# Altium project KB-Mouse Interface.PrjPCB
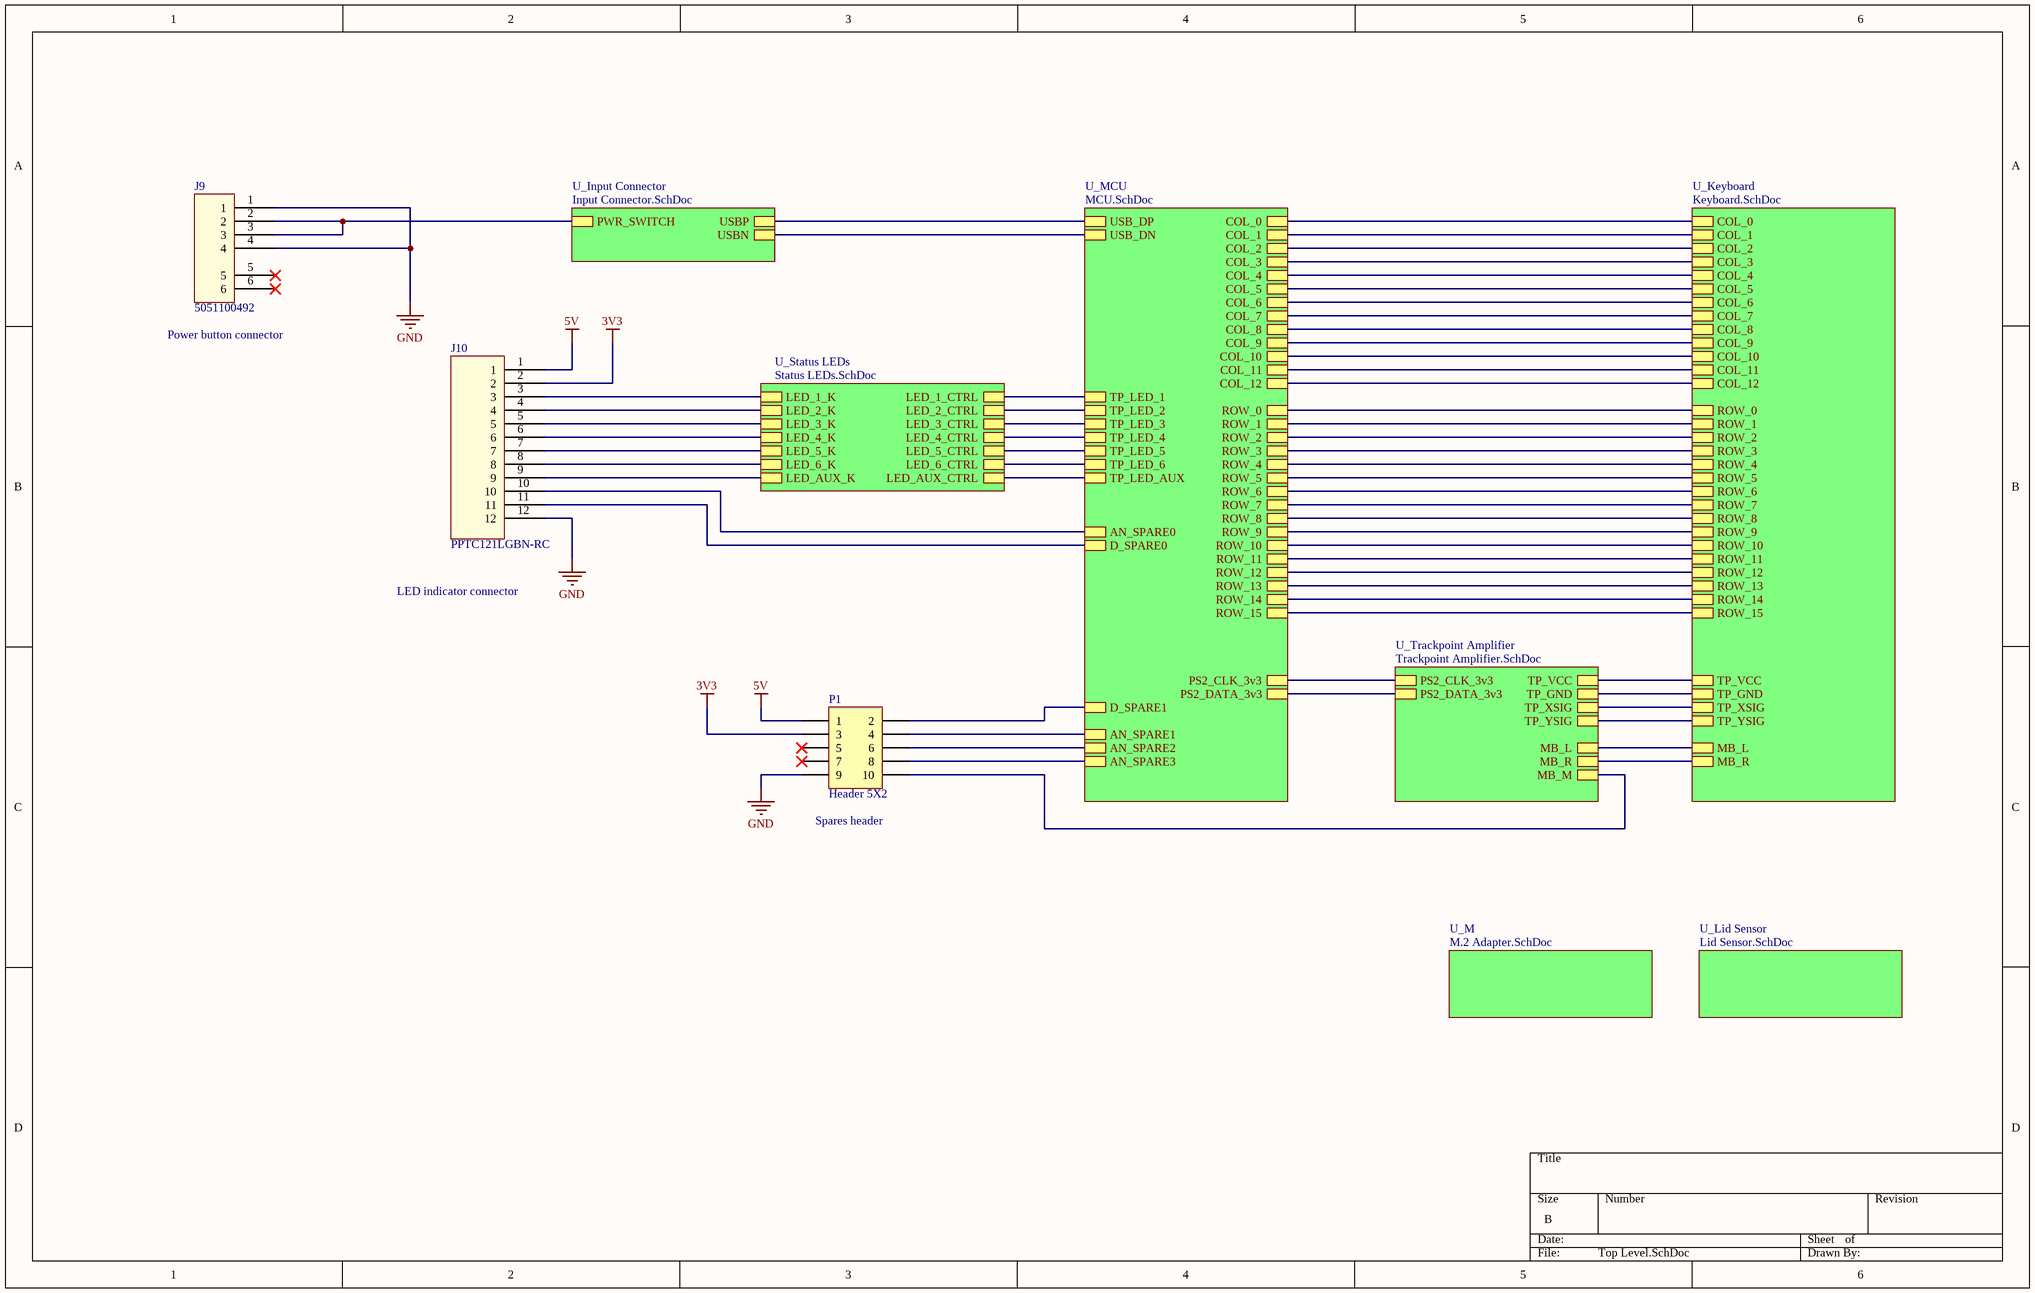
[diagram p0: Top Level.SchDoc]
8 sheets, 66 parts. Net scope: hierarchical (ports join the sheet entries above them; power ports are global).
Board file: KB-Mouse Interface.PcbDoc
Sheets:
  Top Level.SchDoc
    U_Input Connector = Input Connector.SchDoc
    U_Keyboard = Keyboard.SchDoc
    U_MCU = MCU.SchDoc
    U_Status LEDs = Status LEDs.SchDoc
    U_Trackpoint Amplifier = Trackpoint Amplifier.SchDoc
    U_Lid Sensor = Lid Sensor.SchDoc
    U_M = M.2 Adapter.SchDoc

## Sheet Top Level.SchDoc
size B

### Parts
J9  5051100492  [5051100492]
J10  PPTC121LGBN-RC  [PPTC121LGBN-RC]
P1  Header 5X2  [HDR2X5]

### Sub-sheets
U_Input Connector = Input Connector.SchDoc: USBN, USBP, PWR_SWITCH
U_Keyboard = Keyboard.SchDoc: MB_L, MB_R, COL_1, COL_2, COL_3, COL_4, COL_5, COL_6, COL_7, COL_8, COL_9, COL_10, COL_11, COL_12, COL_0, ROW_1, ROW_2, ROW_3, ROW_4, ROW_5, ROW_6, ROW_7, ROW_0, ROW_9, ROW_10, ROW_11, ROW_12, ROW_13, ROW_14, ROW_15, ROW_8, TP_GND, TP_XSIG, TP_YSIG, TP_VCC
U_Lid Sensor = Lid Sensor.SchDoc: no entries
U_M = M.2 Adapter.SchDoc: no entries
U_MCU = MCU.SchDoc: USB_DP, USB_DN, AN_SPARE2, AN_SPARE1, TP_LED_1, TP_LED_2, TP_LED_3, TP_LED_4, TP_LED_5, TP_LED_6, COL_1, COL_2, COL_3, COL_4, COL_5, COL_6, COL_7, COL_8, COL_9, COL_10, COL_11, COL_12, COL_0, ROW_1, ROW_2, ROW_3, ROW_4, ROW_5, ROW_6, ROW_7, ROW_0, ROW_9, ROW_10, ROW_11, ROW_12, ROW_13, ROW_14, ROW_15, ROW_8, PS2_CLK_3v3, PS2_DATA_3v3, TP_LED_AUX, D_SPARE0, D_SPARE1, AN_SPARE0, AN_SPARE3
U_Status LEDs = Status LEDs.SchDoc: LED_1_CTRL, LED_1_K, LED_2_CTRL, LED_2_K, LED_3_CTRL, LED_3_K, LED_4_CTRL, LED_4_K, LED_5_CTRL, LED_5_K, LED_6_CTRL, LED_6_K, LED_AUX_CTRL, LED_AUX_K
U_Trackpoint Amplifier = Trackpoint Amplifier.SchDoc: TP_VCC, TP_GND, TP_XSIG, TP_YSIG, PS2_DATA_3v3, PS2_CLK_3v3, MB_M, MB_R, MB_L

### Nets
3V3: J10.2 P1.3
5V: J10.1 P1.1
GND: J9.1 J9.4 J10.12 P1.9
COL_0: sheet U_Keyboard/COL_0, sheet U_MCU/COL_0
COL_1: sheet U_Keyboard/COL_1, sheet U_MCU/COL_1
COL_2: sheet U_Keyboard/COL_2, sheet U_MCU/COL_2
COL_3: sheet U_Keyboard/COL_3, sheet U_MCU/COL_3
COL_4: sheet U_Keyboard/COL_4, sheet U_MCU/COL_4
COL_5: sheet U_Keyboard/COL_5, sheet U_MCU/COL_5
COL_6: sheet U_Keyboard/COL_6, sheet U_MCU/COL_6
COL_7: sheet U_Keyboard/COL_7, sheet U_MCU/COL_7
COL_8: sheet U_Keyboard/COL_8, sheet U_MCU/COL_8
COL_9: sheet U_Keyboard/COL_9, sheet U_MCU/COL_9
COL_10: sheet U_Keyboard/COL_10, sheet U_MCU/COL_10
COL_11: sheet U_Keyboard/COL_11, sheet U_MCU/COL_11
COL_12: sheet U_Keyboard/COL_12, sheet U_MCU/COL_12
ROW_0: sheet U_Keyboard/ROW_0, sheet U_MCU/ROW_0
ROW_1: sheet U_Keyboard/ROW_1, sheet U_MCU/ROW_1
ROW_2: sheet U_Keyboard/ROW_2, sheet U_MCU/ROW_2
ROW_3: sheet U_Keyboard/ROW_3, sheet U_MCU/ROW_3
ROW_4: sheet U_Keyboard/ROW_4, sheet U_MCU/ROW_4
ROW_5: sheet U_Keyboard/ROW_5, sheet U_MCU/ROW_5
ROW_6: sheet U_Keyboard/ROW_6, sheet U_MCU/ROW_6
ROW_7: sheet U_Keyboard/ROW_7, sheet U_MCU/ROW_7
ROW_8: sheet U_Keyboard/ROW_8, sheet U_MCU/ROW_8
ROW_9: sheet U_Keyboard/ROW_9, sheet U_MCU/ROW_9
ROW_10: sheet U_Keyboard/ROW_10, sheet U_MCU/ROW_10
ROW_11: sheet U_Keyboard/ROW_11, sheet U_MCU/ROW_11
ROW_12: sheet U_Keyboard/ROW_12, sheet U_MCU/ROW_12
ROW_13: sheet U_Keyboard/ROW_13, sheet U_MCU/ROW_13
ROW_14: sheet U_Keyboard/ROW_14, sheet U_MCU/ROW_14
ROW_15: sheet U_Keyboard/ROW_15, sheet U_MCU/ROW_15
NetC1_2: sheet U_Keyboard/MB_L, sheet U_Trackpoint Amplifier/MB_L
NetC2_2: sheet U_Keyboard/MB_R, sheet U_Trackpoint Amplifier/MB_R
NetJ2_40: sheet U_Input Connector/USBN, sheet U_MCU/USB_DN
NetJ2_42: sheet U_Input Connector/USBP, sheet U_MCU/USB_DP
NetJ2_44: J9.2 J9.3 ; sheet U_Input Connector/PWR_SWITCH
NetJ3_1: sheet U_Keyboard/TP_XSIG, sheet U_Trackpoint Amplifier/TP_XSIG
NetJ3_2: sheet U_Keyboard/TP_VCC, sheet U_Trackpoint Amplifier/TP_VCC
NetJ3_3: sheet U_Keyboard/TP_YSIG, sheet U_Trackpoint Amplifier/TP_YSIG
NetJ3_5: sheet U_Keyboard/TP_GND, sheet U_Trackpoint Amplifier/TP_GND
NetJ10_3: J10.3 ; sheet U_Status LEDs/LED_1_K
NetJ10_4: J10.4 ; sheet U_Status LEDs/LED_2_K
NetJ10_5: J10.5 ; sheet U_Status LEDs/LED_3_K
NetJ10_6: J10.6 ; sheet U_Status LEDs/LED_4_K
NetJ10_7: J10.7 ; sheet U_Status LEDs/LED_5_K
NetJ10_8: J10.8 ; sheet U_Status LEDs/LED_6_K
NetJ10_9: J10.9 ; sheet U_Status LEDs/LED_AUX_K
NetJ10_10: J10.10 ; sheet U_MCU/AN_SPARE0
NetJ10_11: J10.11 ; sheet U_MCU/D_SPARE0
NetP1_2: P1.2 ; sheet U_MCU/D_SPARE1
NetP1_4: P1.4 ; sheet U_MCU/AN_SPARE1
NetP1_6: P1.6 ; sheet U_MCU/AN_SPARE2
NetP1_8: P1.8 ; sheet U_MCU/AN_SPARE3
NetP1_10: P1.10 ; sheet U_Trackpoint Amplifier/MB_M
NetQ1_2: sheet U_MCU/TP_LED_1, sheet U_Status LEDs/LED_1_CTRL
NetQ2_2: sheet U_MCU/TP_LED_2, sheet U_Status LEDs/LED_2_CTRL
NetQ3_2: sheet U_MCU/TP_LED_3, sheet U_Status LEDs/LED_3_CTRL
NetQ4_2: sheet U_MCU/TP_LED_4, sheet U_Status LEDs/LED_4_CTRL
NetQ5_2: sheet U_MCU/TP_LED_5, sheet U_Status LEDs/LED_5_CTRL
NetQ6_2: sheet U_MCU/TP_LED_6, sheet U_Status LEDs/LED_6_CTRL
NetQ7_2: sheet U_MCU/TP_LED_AUX, sheet U_Status LEDs/LED_AUX_CTRL
NetQ8_1: sheet U_MCU/PS2_DATA_3v3, sheet U_Trackpoint Amplifier/PS2_DATA_3v3
NetQ9_1: sheet U_MCU/PS2_CLK_3v3, sheet U_Trackpoint Amplifier/PS2_CLK_3v3

Not connected (* = marked no-connect by the designer): J9 5* 6*; P1 5* 7*

### Notes on the sheet
- (near J9) Power button connector
- LED indicator connector
- (near P1) Spares header

### Library data of the parts
J9 = 5051100492: CONN FPC BOTTOM 4POS .5MM R/A
J10 = PPTC121LGBN-RC: CONN HDR 12POS 0.1 TIN PCB R/A
P1 = Header 5X2: Header, 5-Pin, Dual row; LatestRevisionDate: 17-Jul-2002; LatestRevisionNote: Re-released for DXP Platform.; Publisher: Altium Limited

## Sheet Input Connector.SchDoc
size B
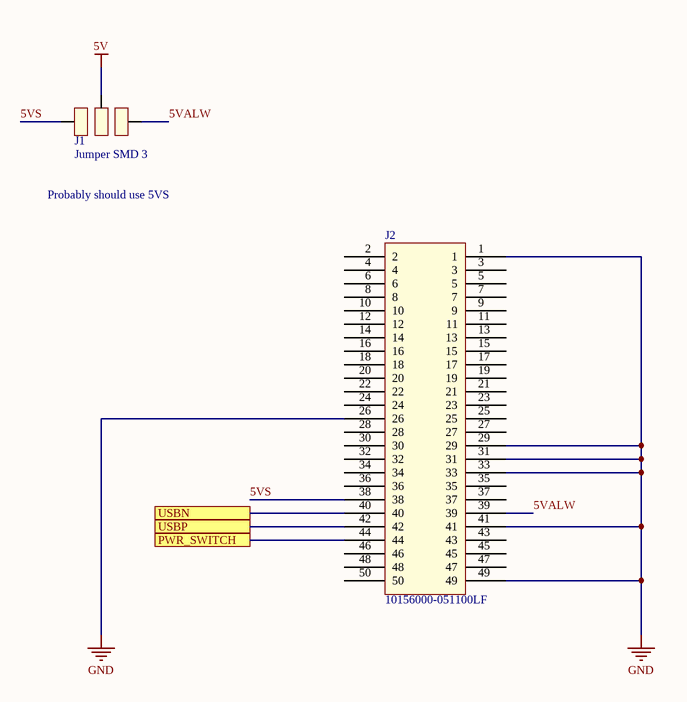
[diagram p1: Input Connector.SchDoc]

### Parts
J1  Jumper SMD 3  [Jumper SMD 3]
J2  10156000-051100LF  [10156000-051100LF]

### Ports
PWR_SWITCH, USBN, USBP

### Nets
5V: J1.2
GND: J2.1 J2.26 J2.29 J2.31 J2.33 J2.41 J2.49
5VALW: J1.1 J2.39
5VS: J1.3 J2.38
NetJ2_40: J2.40 ; port USBN
NetJ2_42: J2.42 ; port USBP
NetJ2_44: J2.44 ; port PWR_SWITCH

Not connected (* = marked no-connect by the designer): J2 2 3 4 5 6 7 8 9 10 11 12 13 14 15 16 17 18 19 20 21 22 23 24 25 27 28 30 32 34 35 36 37 43 45 46 47 48 50

### Notes on the sheet
- Probably should use 5VS

## Sheet Keyboard.SchDoc
size B
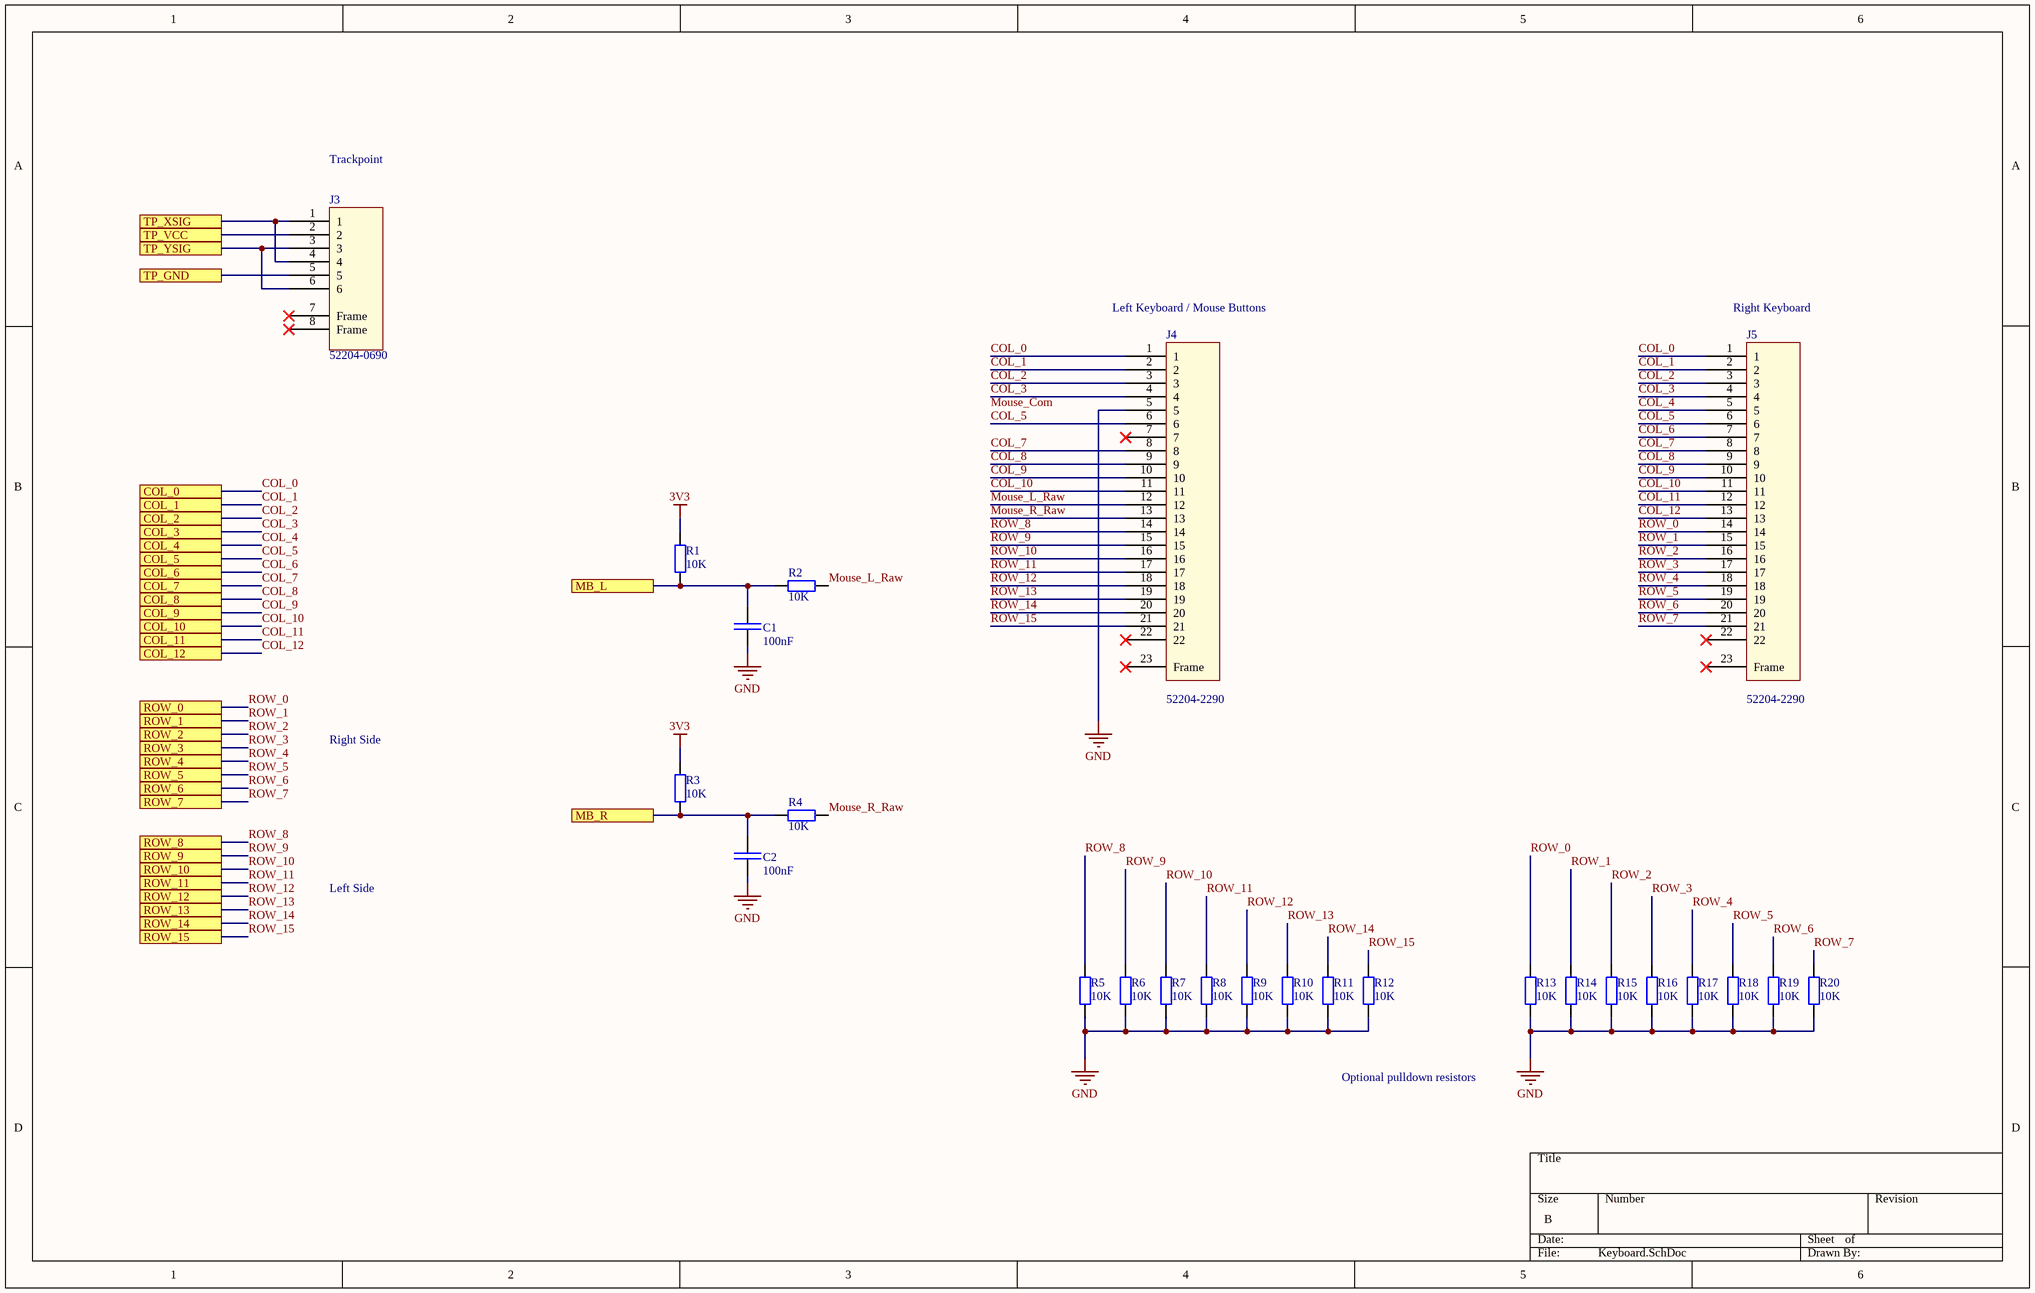
[diagram p2: Keyboard.SchDoc]

### Parts
C1  100nF  [CAP_SM0603_YAGEOCC2_N]
C2  100nF  [CAP_SM0603_YAGEOCC2_N]
J3  52204-0690  [52204-0690]
J4  52204-2290  [52204-2290]
J5  52204-2290  [52204-2290]
R1  10K  [RES_SM0603_YAGEORC_N]
R2  10K  [RES_SM0603_YAGEORC_N]
R3  10K  [RES_SM0603_YAGEORC_N]
R4  10K  [RES_SM0603_YAGEORC_N]
R5  10K  [RES_SM0603_YAGEORC_N]
R6  10K  [RES_SM0603_YAGEORC_N]
R7  10K  [RES_SM0603_YAGEORC_N]
R8  10K  [RES_SM0603_YAGEORC_N]
R9  10K  [RES_SM0603_YAGEORC_N]
R10  10K  [RES_SM0603_YAGEORC_N]
R11  10K  [RES_SM0603_YAGEORC_N]
R12  10K  [RES_SM0603_YAGEORC_N]
R13  10K  [RES_SM0603_YAGEORC_N]
R14  10K  [RES_SM0603_YAGEORC_N]
R15  10K  [RES_SM0603_YAGEORC_N]
R16  10K  [RES_SM0603_YAGEORC_N]
R17  10K  [RES_SM0603_YAGEORC_N]
R18  10K  [RES_SM0603_YAGEORC_N]
R19  10K  [RES_SM0603_YAGEORC_N]
R20  10K  [RES_SM0603_YAGEORC_N]

### Ports
COL_0, COL_1, COL_2, COL_3, COL_4, COL_5, COL_6, COL_7, COL_8, COL_9, COL_10, COL_11, COL_12, MB_L, MB_R, ROW_0, ROW_1, ROW_2, ROW_3, ROW_4, ROW_5, ROW_6, ROW_7, ROW_8, ROW_9, ROW_10, ROW_11, ROW_12, ROW_13, ROW_14, ROW_15, TP_GND, TP_VCC, TP_XSIG, TP_YSIG

### Nets
3V3: R1.1 R3.1
GND: C1.1 C2.1 J4.5 R5.2 R6.2 R7.2 R8.2 R9.2 R10.2 R11.2 R12.2 R13.2 R14.2 R15.2 R16.2 R17.2 R18.2 R19.2 R20.2
COL_0: J4.1 J5.1 ; port COL_0
COL_1: J4.2 J5.2 ; port COL_1
COL_2: J4.3 J5.3 ; port COL_2
COL_3: J4.4 J5.4 ; port COL_3
COL_4: J5.5 ; port COL_4
COL_5: J4.6 J5.6 ; port COL_5
COL_6: J5.7 ; port COL_6
COL_7: J4.8 J5.8 ; port COL_7
COL_8: J4.9 J5.9 ; port COL_8
COL_9: J4.10 J5.10 ; port COL_9
COL_10: J4.11 J5.11 ; port COL_10
COL_11: J5.12 ; port COL_11
COL_12: J5.13 ; port COL_12
Mouse_L_Raw: J4.12 R2.1
Mouse_R_Raw: J4.13 R4.1
ROW_0: J5.14 R13.1 ; port ROW_0
ROW_1: J5.15 R14.1 ; port ROW_1
ROW_2: J5.16 R15.1 ; port ROW_2
ROW_3: J5.17 R16.1 ; port ROW_3
ROW_4: J5.18 R17.1 ; port ROW_4
ROW_5: J5.19 R18.1 ; port ROW_5
ROW_6: J5.20 R19.1 ; port ROW_6
ROW_7: J5.21 R20.1 ; port ROW_7
ROW_8: J4.14 R5.1 ; port ROW_8
ROW_9: J4.15 R6.1 ; port ROW_9
ROW_10: J4.16 R7.1 ; port ROW_10
ROW_11: J4.17 R8.1 ; port ROW_11
ROW_12: J4.18 R9.1 ; port ROW_12
ROW_13: J4.19 R10.1 ; port ROW_13
ROW_14: J4.20 R11.1 ; port ROW_14
ROW_15: J4.21 R12.1 ; port ROW_15
NetC1_2: C1.2 R1.2 R2.2 ; port MB_L
NetC2_2: C2.2 R3.2 R4.2 ; port MB_R
NetJ3_1: J3.1 J3.4 ; port TP_XSIG
NetJ3_2: J3.2 ; port TP_VCC
NetJ3_3: J3.3 J3.6 ; port TP_YSIG
NetJ3_5: J3.5 ; port TP_GND

Not connected (* = marked no-connect by the designer): J3 7(Frame)* 8(Frame)*; J4 7* 22* 23(Frame)*; J5 22* 23(Frame)*

### Notes on the sheet
- Trackpoint
- (near J4) Left Keyboard / Mouse Buttons
- (near J5) Right Keyboard
- Right Side
- Left Side
- Optional pulldown resistors
- Labels drawn without touching a wire or pin: Mouse_Com

### Library data of the parts
C1 C2 = CC0603KRX7R9BB104: CAP 100nF SM0603 X7R 50V YAGEO CC2; Tolerance (%): 10; Voltage Rating (Volts): 50; Value: 100nF; Category: Capacitor; Manufacturer: Yageo; Manufacturer Part Number: CC0603KRX7R9BB104; Package: 0603; Supplier Part Number 1: 1362556; Supplier 1: Farnell; ComponentLink1URL: http://www.yageo.com; ComponentLink1Description: Manufacturer Website; Supplier 2: Digi-Key; Supplier Part Number 2: 311-1344-1-ND
R1-R20 = RC0603FR-0710KL: RES 10K SM0603 YAGEO RC_L; Power (Watts): 0.1; Resistance (Ohms): 10000; Tolerance (%): 1; Value: 10K; Category: Resistor; Manufacturer: Yageo; Manufacturer Part Number: RC0603FR-0710KL; Package: 0603; Supplier Part Number 1: 9238603; Supplier 1: Farnell; ComponentLink1URL: http://www.yageo.com; ComponentLink1Description: Manufacturer Website; Supplier 2: Digi-Key; Supplier Part Number 2: 311-10.0KHRCT-ND

## Sheet MCU.SchDoc
size B
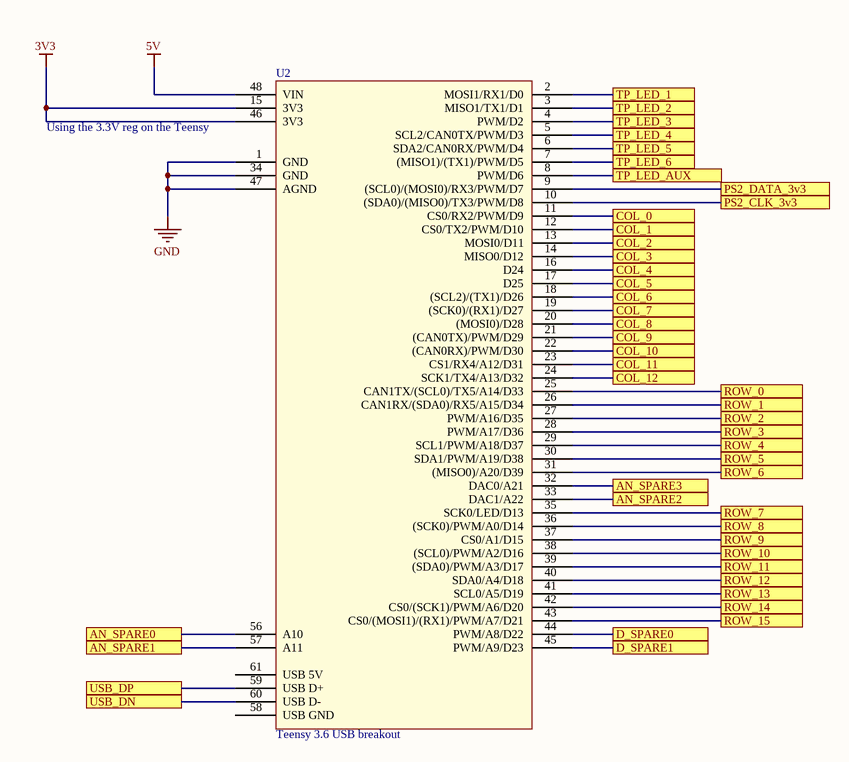
[diagram p3: MCU.SchDoc]

### Parts
U2  Teensy 3.6 USB breakout  [Teensy 3.6 - USB Breakout]

### Ports
AN_SPARE0, AN_SPARE1, AN_SPARE2, AN_SPARE3, COL_0, COL_1, COL_2, COL_3, COL_4, COL_5, COL_6, COL_7, COL_8, COL_9, COL_10, COL_11, COL_12, D_SPARE0, D_SPARE1, PS2_CLK_3v3, PS2_DATA_3v3, ROW_0, ROW_1, ROW_2, ROW_3, ROW_4, ROW_5, ROW_6, ROW_7, ROW_8, ROW_9, ROW_10, ROW_11, ROW_12, ROW_13, ROW_14, ROW_15, TP_LED_1, TP_LED_2, TP_LED_3, TP_LED_4, TP_LED_5, TP_LED_6, TP_LED_AUX, USB_DN, USB_DP

### Nets
3V3: U2.15(3V3) U2.46(3V3)
5V: U2.48(VIN)
GND: U2.1(GND) U2.34(GND) U2.47(AGND)
COL_0: U2.11(CS0/RX2/PWM/D9) ; port COL_0
COL_1: U2.12(CS0/TX2/PWM/D10) ; port COL_1
COL_2: U2.13(MOSI0/D11) ; port COL_2
COL_3: U2.14(MISO0/D12) ; port COL_3
COL_4: U2.16(D24) ; port COL_4
COL_5: U2.17(D25) ; port COL_5
COL_6: U2.18((SCL2)/(TX1)/D26) ; port COL_6
COL_7: U2.19((SCK0)/(RX1)/D27) ; port COL_7
COL_8: U2.20((MOSI0)/D28) ; port COL_8
COL_9: U2.21((CAN0TX)/PWM/D29) ; port COL_9
COL_10: U2.22((CAN0RX)/PWM/D30) ; port COL_10
COL_11: U2.23(CS1/RX4/A12/D31) ; port COL_11
COL_12: U2.24(SCK1/TX4/A13/D32) ; port COL_12
ROW_0: U2.25(CAN1TX/(SCL0)/TX5/A14/D33) ; port ROW_0
ROW_1: U2.26(CAN1RX/(SDA0)/RX5/A15/D34) ; port ROW_1
ROW_2: U2.27(PWM/A16/D35) ; port ROW_2
ROW_3: U2.28(PWM/A17/D36) ; port ROW_3
ROW_4: U2.29(SCL1/PWM/A18/D37) ; port ROW_4
ROW_5: U2.30(SDA1/PWM/A19/D38) ; port ROW_5
ROW_6: U2.31((MISO0)/A20/D39) ; port ROW_6
ROW_7: U2.35(SCK0/LED/D13) ; port ROW_7
ROW_8: U2.36((SCK0)/PWM/A0/D14) ; port ROW_8
ROW_9: U2.37(CS0/A1/D15) ; port ROW_9
ROW_10: U2.38((SCL0)/PWM/A2/D16) ; port ROW_10
ROW_11: U2.39((SDA0)/PWM/A3/D17) ; port ROW_11
ROW_12: U2.40(SDA0/A4/D18) ; port ROW_12
ROW_13: U2.41(SCL0/A5/D19) ; port ROW_13
ROW_14: U2.42(CS0/(SCK1)/PWM/A6/D20) ; port ROW_14
ROW_15: U2.43(CS0/(MOSI1)/(RX1)/PWM/A7/D21) ; port ROW_15
NetJ2_40: U2.60(USB_D-) ; port USB_DN
NetJ2_42: U2.59(USB_D+) ; port USB_DP
NetJ10_10: U2.56(A10) ; port AN_SPARE0
NetJ10_11: U2.44(PWM/A8/D22) ; port D_SPARE0
NetP1_2: U2.45(PWM/A9/D23) ; port D_SPARE1
NetP1_4: U2.57(A11) ; port AN_SPARE1
NetP1_6: U2.33(DAC1/A22) ; port AN_SPARE2
NetP1_8: U2.32(DAC0/A21) ; port AN_SPARE3
NetQ1_2: U2.2(MOSI1/RX1/D0) ; port TP_LED_1
NetQ2_2: U2.3(MISO1/TX1/D1) ; port TP_LED_2
NetQ3_2: U2.4(PWM/D2) ; port TP_LED_3
NetQ4_2: U2.5(SCL2/CAN0TX/PWM/D3) ; port TP_LED_4
NetQ5_2: U2.6(SDA2/CAN0RX/PWM/D4) ; port TP_LED_5
NetQ6_2: U2.7((MISO1)/(TX1)/PWM/D5) ; port TP_LED_6
NetQ7_2: U2.8(PWM/D6) ; port TP_LED_AUX
NetQ8_1: U2.9((SCL0)/(MOSI0)/RX3/PWM/D7) ; port PS2_DATA_3v3
NetQ9_1: U2.10((SDA0)/(MISO0)/TX3/PWM/D8) ; port PS2_CLK_3v3

Not connected (* = marked no-connect by the designer): U2 58(USB_GND) 61(USB_5V)

### Notes on the sheet
- (near U2) Using the 3.3V reg on the Teensy

## Sheet Status LEDs.SchDoc
size B
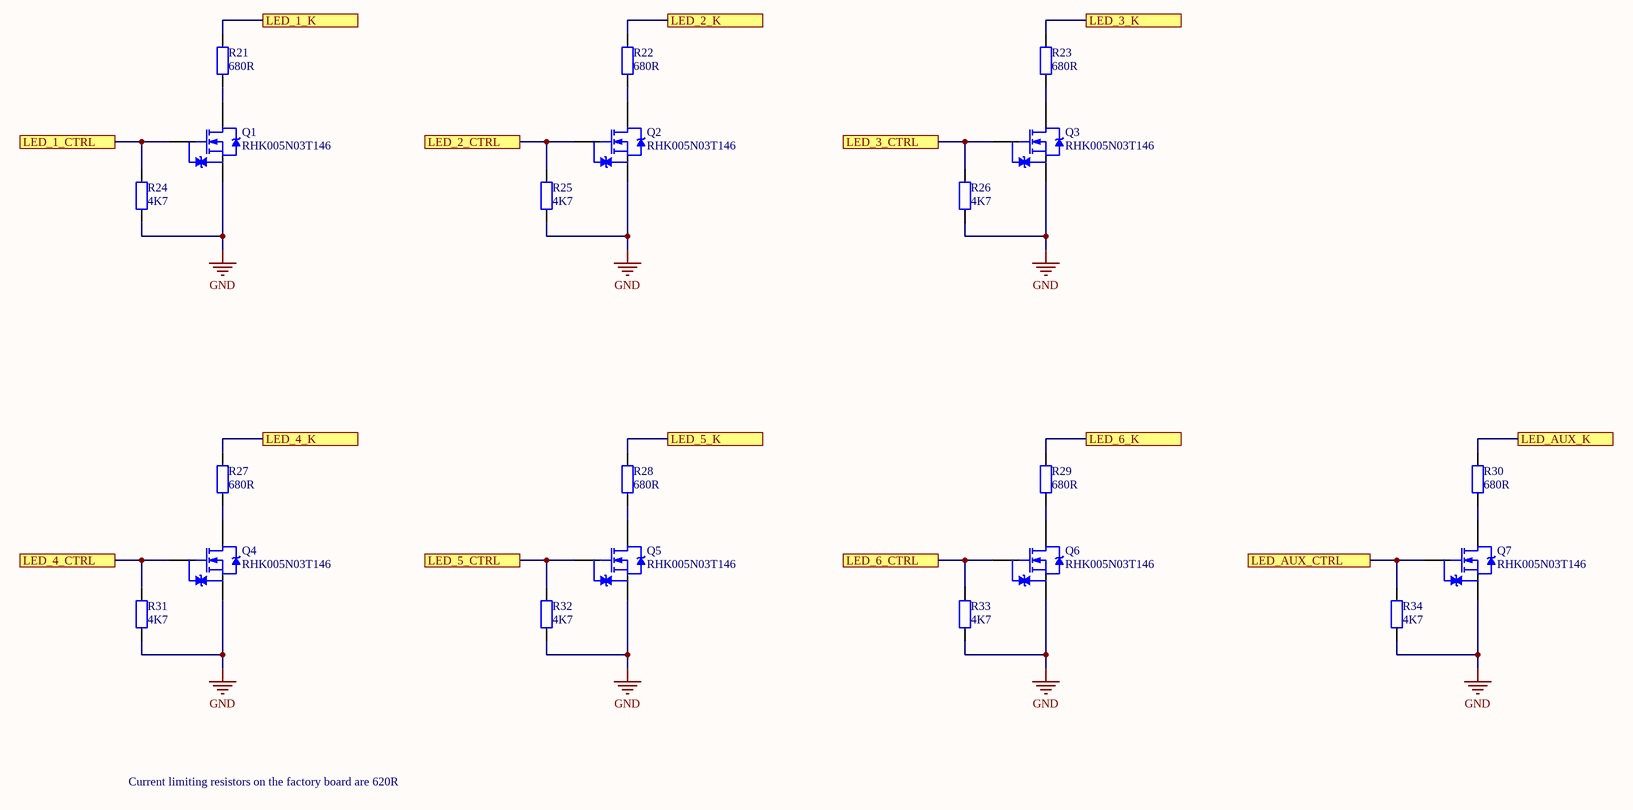
[diagram p4: Status LEDs.SchDoc]

### Parts
Q1  RHK005N03T146  [RHK005N03T146 - SOT95P280X110-3N]
Q2  RHK005N03T146  [RHK005N03T146 - SOT95P280X110-3N]
Q3  RHK005N03T146  [RHK005N03T146 - SOT95P280X110-3N]
Q4  RHK005N03T146  [RHK005N03T146 - SOT95P280X110-3N]
Q5  RHK005N03T146  [RHK005N03T146 - SOT95P280X110-3N]
Q6  RHK005N03T146  [RHK005N03T146 - SOT95P280X110-3N]
Q7  RHK005N03T146  [RHK005N03T146 - SOT95P280X110-3N]
R21  680R  [RES_SM0603_YAGEORC_N]
R22  680R  [RES_SM0603_YAGEORC_N]
R23  680R  [RES_SM0603_YAGEORC_N]
R24  4K7  [RES_SM0603_YAGEORC_N]
R25  4K7  [RES_SM0603_YAGEORC_N]
R26  4K7  [RES_SM0603_YAGEORC_N]
R27  680R  [RES_SM0603_YAGEORC_N]
R28  680R  [RES_SM0603_YAGEORC_N]
R29  680R  [RES_SM0603_YAGEORC_N]
R30  680R  [RES_SM0603_YAGEORC_N]
R31  4K7  [RES_SM0603_YAGEORC_N]
R32  4K7  [RES_SM0603_YAGEORC_N]
R33  4K7  [RES_SM0603_YAGEORC_N]
R34  4K7  [RES_SM0603_YAGEORC_N]

### Ports
LED_1_CTRL, LED_1_K, LED_2_CTRL, LED_2_K, LED_3_CTRL, LED_3_K, LED_4_CTRL, LED_4_K, LED_5_CTRL, LED_5_K, LED_6_CTRL, LED_6_K, LED_AUX_CTRL, LED_AUX_K

### Nets
GND: Q1.1(S) Q2.1(S) Q3.1(S) Q4.1(S) Q5.1(S) Q6.1(S) Q7.1(S) R24.1 R25.1 R26.1 R31.1 R32.1 R33.1 R34.1
NetJ10_3: R21.2 ; port LED_1_K
NetJ10_4: R22.2 ; port LED_2_K
NetJ10_5: R23.2 ; port LED_3_K
NetJ10_6: R27.2 ; port LED_4_K
NetJ10_7: R28.2 ; port LED_5_K
NetJ10_8: R29.2 ; port LED_6_K
NetJ10_9: R30.2 ; port LED_AUX_K
NetQ1_2: Q1.2(G) R24.2 ; port LED_1_CTRL
NetQ1_3: Q1.3(D) R21.1
NetQ2_2: Q2.2(G) R25.2 ; port LED_2_CTRL
NetQ2_3: Q2.3(D) R22.1
NetQ3_2: Q3.2(G) R26.2 ; port LED_3_CTRL
NetQ3_3: Q3.3(D) R23.1
NetQ4_2: Q4.2(G) R31.2 ; port LED_4_CTRL
NetQ4_3: Q4.3(D) R27.1
NetQ5_2: Q5.2(G) R32.2 ; port LED_5_CTRL
NetQ5_3: Q5.3(D) R28.1
NetQ6_2: Q6.2(G) R33.2 ; port LED_6_CTRL
NetQ6_3: Q6.3(D) R29.1
NetQ7_2: Q7.2(G) R34.2 ; port LED_AUX_CTRL
NetQ7_3: Q7.3(D) R30.1

### Notes on the sheet
- Current limiting resistors on the factory board are 620R

### Library data of the parts
Q1-Q7 = RHK005N03T146: MOSFET N-CH 30V 500MA
R21-R23 R27-R30 = RC0603FR-07680RL: RES 680R SM0603 YAGEO RC_L; Power (Watts): 0.1; Resistance (Ohms): 680; Tolerance (%): 1; Value: 680R; Category: Resistor; Manufacturer: Yageo; Manufacturer Part Number: RC0603FR-07680RL; Package: 0603; Supplier Part Number 1: 9238468; Supplier 1: Farnell; ComponentLink1URL: http://www.yageo.com; ComponentLink1Description: Manufacturer Website; Supplier 2: Digi-Key; Supplier Part Number 2: 311-680HRCT-ND
R24-R26 R31-R34 = RC0603FR-074K7L: RES 4K7 SM0603 YAGEO RC_L; Power (Watts): 0.1; Resistance (Ohms): 4700; Tolerance (%): 1; Value: 4K7; Category: Resistor; Manufacturer: Yageo; Manufacturer Part Number: RC0603FR-074K7L; Package: 0603; Supplier Part Number 1: 9238565; Supplier 1: Farnell; ComponentLink1URL: http://www.yageo.com; ComponentLink1Description: Manufacturer Website; Supplier 2: Digi-Key; Supplier Part Number 2: 311-4.70KHRCT-ND

## Sheet Trackpoint Amplifier.SchDoc
size B
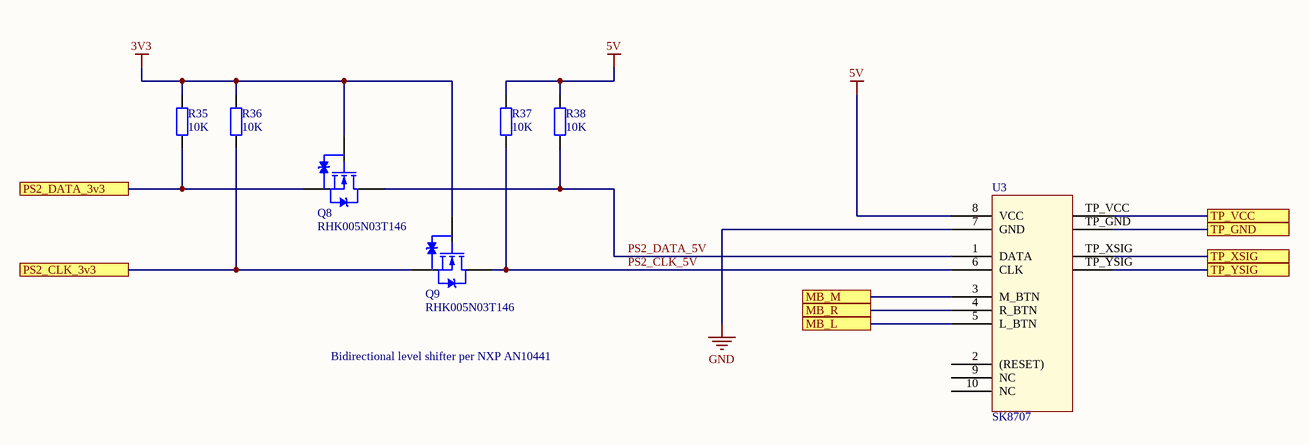
[diagram p5: Trackpoint Amplifier.SchDoc]

### Parts
Q8  RHK005N03T146  [RHK005N03T146 - SOT95P280X110-3N]
Q9  RHK005N03T146  [RHK005N03T146 - SOT95P280X110-3N]
R35  10K  [RES_SM0603_YAGEORC_N]
R36  10K  [RES_SM0603_YAGEORC_N]
R37  10K  [RES_SM0603_YAGEORC_N]
R38  10K  [RES_SM0603_YAGEORC_N]
U3  SK8707  [SK8707]

### Ports
MB_L, MB_M, MB_R, PS2_CLK_3v3, PS2_DATA_3v3, TP_GND, TP_VCC, TP_XSIG, TP_YSIG

### Nets
3V3: Q8.2(G) Q9.2(G) R35.2 R36.2
5V: R37.2 R38.2 U3.8(VCC)
GND: U3.7(GND)
PS2_CLK_5V: Q9.3(D) R37.1 U3.6(CLK)
PS2_DATA_5V: Q8.3(D) R38.1 U3.1(DATA)
NetC1_2: U3.5(L_BTN) ; port MB_L
NetC2_2: U3.4(R_BTN) ; port MB_R
NetJ3_1: U3.TP_XSIG ; port TP_XSIG
NetJ3_2: U3.TP_VCC ; port TP_VCC
NetJ3_3: U3.TP_YSIG ; port TP_YSIG
NetJ3_5: U3.TP_GND ; port TP_GND
NetP1_10: U3.3(M_BTN) ; port MB_M
NetQ8_1: Q8.1(S) R35.1 ; port PS2_DATA_3v3
NetQ9_1: Q9.1(S) R36.1 ; port PS2_CLK_3v3

Not connected (* = marked no-connect by the designer): U3 2((RESET)) 9(NC) 10(NC)

### Notes on the sheet
- Bidirectional level shifter per NXP AN10441

### Library data of the parts
Q8 Q9 = RHK005N03T146: MOSFET N-CH 30V 500MA
R35-R38 = RC0603FR-0710KL: as R1 on sheet Keyboard; Value: 10K; Category: Resistor; Manufacturer: Yageo; Manufacturer Part Number: RC0603FR-0710KL; Package: 0603; Supplier Part Number 1: 9238603; Supplier 1: Farnell; ComponentLink1URL: http://www.yageo.com; ComponentLink1Description: Manufacturer Website; Supplier 2: Digi-Key; Supplier Part Number 2: 311-10.0KHRCT-ND

## Sheet Lid Sensor.SchDoc
size B
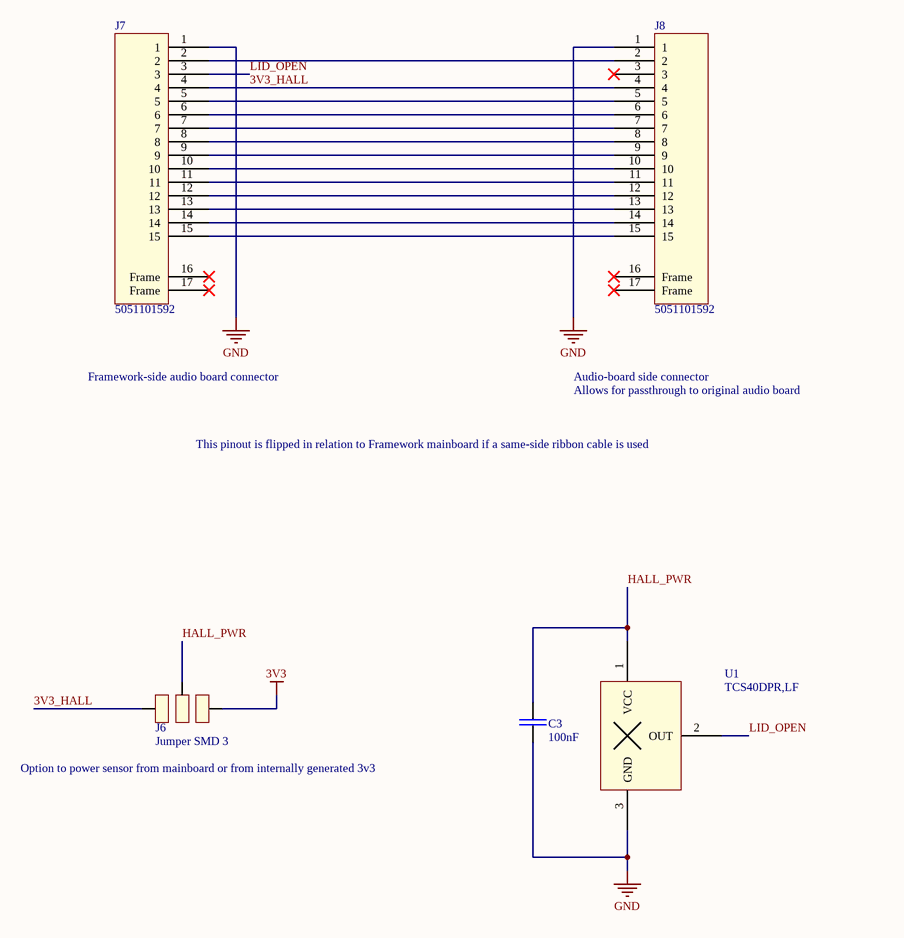
[diagram p6: Lid Sensor.SchDoc]

### Parts
C3  100nF  [CAP_SM0603_YAGEOCC2_N]
J6  Jumper SMD 3  [Jumper SMD 3]
J7  5051101592  [5051101592]
J8  5051101592  [5051101592]
U1  TCS40DPR,LF  [TCS40DPR,LF - SOT23127P600-8N]

### Nets
3V3: J6.1
GND: C3.1 J7.1 J8.1 U1.3(GND)
3V3_HALL: J6.3 J7.4 J8.4
HALL_PWR: C3.2 J6.2 U1.1(VCC)
LID_OPEN: J7.3 U1.2(OUT)
NetJ7_2: J7.2 J8.2
NetJ7_5: J7.5 J8.5
NetJ7_6: J7.6 J8.6
NetJ7_7: J7.7 J8.7
NetJ7_8: J7.8 J8.8
NetJ7_9: J7.9 J8.9
NetJ7_10: J7.10 J8.10
NetJ7_11: J7.11 J8.11
NetJ7_12: J7.12 J8.12
NetJ7_13: J7.13 J8.13
NetJ7_14: J7.14 J8.14
NetJ7_15: J7.15 J8.15

Not connected (* = marked no-connect by the designer): J7 16(Frame)* 17(Frame)*; J8 3* 16(Frame)* 17(Frame)*

### Notes on the sheet
- Framework-side audio board connector
- Audio-board side connector
- Allows for passthrough to original audio board
- This pinout is flipped in relation to Framework mainboard if a same-side ribbon cable is used
- Option to power sensor from mainboard or from internally generated 3v3

### Library data of the parts
C3 = CC0603KRX7R9BB104: as C1 on sheet Keyboard; Value: 100nF; Category: Capacitor; Manufacturer: Yageo; Manufacturer Part Number: CC0603KRX7R9BB104; Package: 0603; Supplier Part Number 1: 1362556; Supplier 1: Farnell; ComponentLink1URL: http://www.yageo.com; ComponentLink1Description: Manufacturer Website; Supplier 2: Digi-Key; Supplier Part Number 2: 311-1344-1-ND

## Sheet M.2 Adapter.SchDoc
size B
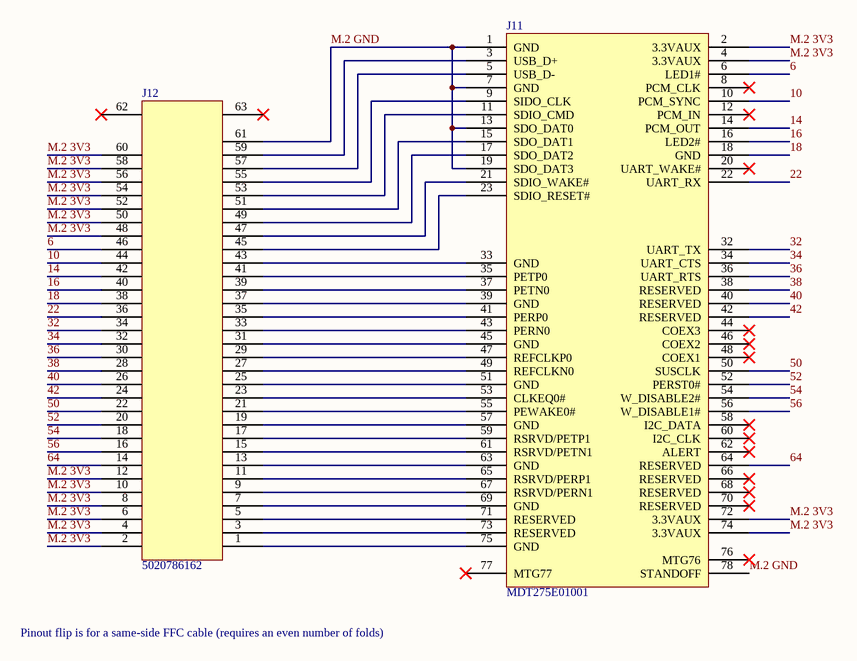
[diagram p7: M.2 Adapter.SchDoc]

### Parts
J11  MDT275E01001  [MDT275E01001]
J12  5020786162  [5020786162]

### Nets
6: J11.6(LED1#) J12.46
10: J11.10(PCM_SYNC) J12.44
14: J11.14(PCM_OUT) J12.42
16: J11.16(LED2#) J12.40
18: J11.18(GND) J12.38
22: J11.22(UART_RX) J12.36
32: J11.32(UART_TX) J12.34
34: J11.34(UART_CTS) J12.32
36: J11.36(UART_RTS) J12.30
38: J11.38(RESERVED) J12.28
40: J11.40(RESERVED) J12.26
42: J11.42(RESERVED) J12.24
50: J11.50(SUSCLK) J12.22
52: J11.52(PERST0#) J12.20
54: J11.54(W_DISABLE2#) J12.18
56: J11.56(W_DISABLE1#) J12.16
64: J11.64(RESERVED) J12.14
M.2 3V3: J11.2(3.3VAUX) J11.4(3.3VAUX) J11.72(3.3VAUX) J11.74(3.3VAUX) J12.2 J12.4 J12.6 J12.8 J12.10 J12.12 J12.48 J12.50 J12.52 J12.54 J12.56 J12.58 J12.60
M.2 GND: J11.1(GND) J11.7(GND) J11.13(SDO_DAT0) J11.19(SDO_DAT3) J11.78(STANDOFF) J12.61
NetJ11_3: J11.3(USB_D+) J12.59
NetJ11_5: J11.5(USB_D-) J12.57
NetJ11_9: J11.9(SIDO_CLK) J12.55
NetJ11_11: J11.11(SDIO_CMD) J12.53
NetJ11_15: J11.15(SDO_DAT1) J12.51
NetJ11_17: J11.17(SDO_DAT2) J12.49
NetJ11_21: J11.21(SDIO_WAKE#) J12.47
NetJ11_23: J11.23(SDIO_RESET#) J12.45
NetJ11_33: J11.33(GND) J12.43
NetJ11_35: J11.35(PETP0) J12.41
NetJ11_37: J11.37(PETN0) J12.39
NetJ11_39: J11.39(GND) J12.37
NetJ11_41: J11.41(PERP0) J12.35
NetJ11_43: J11.43(PERN0) J12.33
NetJ11_45: J11.45(GND) J12.31
NetJ11_47: J11.47(REFCLKP0) J12.29
NetJ11_49: J11.49(REFCLKN0) J12.27
NetJ11_51: J11.51(GND) J12.25
NetJ11_53: J11.53(CLKEQ0#) J12.23
NetJ11_55: J11.55(PEWAKE0#) J12.21
NetJ11_57: J11.57(GND) J12.19
NetJ11_59: J11.59(RSRVD/PETP1) J12.17
NetJ11_61: J11.61(RSRVD/PETN1) J12.15
NetJ11_63: J11.63(GND) J12.13
NetJ11_65: J11.65(RSRVD/PERP1) J12.11
NetJ11_67: J11.67(RSRVD/PERN1) J12.9
NetJ11_69: J11.69(GND) J12.7
NetJ11_71: J11.71(RESERVED) J12.5
NetJ11_73: J11.73(RESERVED) J12.3
NetJ11_75: J11.75(GND) J12.1

Not connected (* = marked no-connect by the designer): J11 8(PCM_CLK)* 12(PCM_IN)* 20(UART_WAKE#)* 44(COEX3)* 46(COEX2)* 48(COEX1)* 58(I2C_DATA)* 60(I2C_CLK)* 62(ALERT)* 66(RESERVED)* 68(RESERVED)* 70(RESERVED)* 76(MTG76)* 77(MTG77)*; J12 62* 63*

### Notes on the sheet
- Pinout flip is for a same-side FFC cable (requires an even number of folds)

### Library data of the parts
J11 = MDT275E01001: CONN M.2 E FMALE 67POS 0.020 GOLD
J12 = 5020786162: Conn FPC Connector SKT 61 POS 0.25mm Solder RA SMD T/R

## Nets that join several sheets
3V3: Top Level (J10.2 P1.3), Keyboard (R1.1 R3.1), MCU (U2.15 U2.46), Trackpoint Amplifier (Q8.2 Q9.2 R35.2 R36.2), Lid Sensor (J6.1)
5V: Top Level (J10.1 P1.1), Input Connector (J1.2), MCU (U2.48), Trackpoint Amplifier (R37.2 R38.2 U3.8)
GND: Top Level (J9.1 J9.4 J10.12 P1.9), Input Connector (7 pins), Keyboard (19 pins), MCU (U2.1 U2.34 U2.47), Status LEDs (14 pins), Trackpoint Amplifier (U3.7), Lid Sensor (C3.1 J7.1 J8.1 U1.3)
COL_0: Keyboard (J4.1 J5.1), MCU (U2.11)
COL_1: Keyboard (J4.2 J5.2), MCU (U2.12)
COL_2: Keyboard (J4.3 J5.3), MCU (U2.13)
COL_3: Keyboard (J4.4 J5.4), MCU (U2.14)
COL_4: Keyboard (J5.5), MCU (U2.16)
COL_5: Keyboard (J4.6 J5.6), MCU (U2.17)
COL_6: Keyboard (J5.7), MCU (U2.18)
COL_7: Keyboard (J4.8 J5.8), MCU (U2.19)
COL_8: Keyboard (J4.9 J5.9), MCU (U2.20)
COL_9: Keyboard (J4.10 J5.10), MCU (U2.21)
COL_10: Keyboard (J4.11 J5.11), MCU (U2.22)
COL_11: Keyboard (J5.12), MCU (U2.23)
COL_12: Keyboard (J5.13), MCU (U2.24)
NetC1_2: Keyboard (C1.2 R1.2 R2.2), Trackpoint Amplifier (U3.5)
NetC2_2: Keyboard (C2.2 R3.2 R4.2), Trackpoint Amplifier (U3.4)
NetJ2_40: Input Connector (J2.40), MCU (U2.60)
NetJ2_42: Input Connector (J2.42), MCU (U2.59)
NetJ2_44: Top Level (J9.2 J9.3), Input Connector (J2.44)
NetJ3_1: Keyboard (J3.1 J3.4), Trackpoint Amplifier (U3.TP_XSIG)
NetJ3_2: Keyboard (J3.2), Trackpoint Amplifier (U3.TP_VCC)
NetJ3_3: Keyboard (J3.3 J3.6), Trackpoint Amplifier (U3.TP_YSIG)
NetJ3_5: Keyboard (J3.5), Trackpoint Amplifier (U3.TP_GND)
NetJ10_3: Top Level (J10.3), Status LEDs (R21.2)
NetJ10_4: Top Level (J10.4), Status LEDs (R22.2)
NetJ10_5: Top Level (J10.5), Status LEDs (R23.2)
NetJ10_6: Top Level (J10.6), Status LEDs (R27.2)
NetJ10_7: Top Level (J10.7), Status LEDs (R28.2)
NetJ10_8: Top Level (J10.8), Status LEDs (R29.2)
NetJ10_9: Top Level (J10.9), Status LEDs (R30.2)
NetJ10_10: Top Level (J10.10), MCU (U2.56)
NetJ10_11: Top Level (J10.11), MCU (U2.44)
NetP1_2: Top Level (P1.2), MCU (U2.45)
NetP1_4: Top Level (P1.4), MCU (U2.57)
NetP1_6: Top Level (P1.6), MCU (U2.33)
NetP1_8: Top Level (P1.8), MCU (U2.32)
NetP1_10: Top Level (P1.10), Trackpoint Amplifier (U3.3)
NetQ1_2: MCU (U2.2), Status LEDs (Q1.2 R24.2)
NetQ2_2: MCU (U2.3), Status LEDs (Q2.2 R25.2)
NetQ3_2: MCU (U2.4), Status LEDs (Q3.2 R26.2)
NetQ4_2: MCU (U2.5), Status LEDs (Q4.2 R31.2)
NetQ5_2: MCU (U2.6), Status LEDs (Q5.2 R32.2)
NetQ6_2: MCU (U2.7), Status LEDs (Q6.2 R33.2)
NetQ7_2: MCU (U2.8), Status LEDs (Q7.2 R34.2)
NetQ8_1: MCU (U2.9), Trackpoint Amplifier (Q8.1 R35.1)
NetQ9_1: MCU (U2.10), Trackpoint Amplifier (Q9.1 R36.1)
ROW_0: Keyboard (J5.14 R13.1), MCU (U2.25)
ROW_1: Keyboard (J5.15 R14.1), MCU (U2.26)
ROW_2: Keyboard (J5.16 R15.1), MCU (U2.27)
ROW_3: Keyboard (J5.17 R16.1), MCU (U2.28)
ROW_4: Keyboard (J5.18 R17.1), MCU (U2.29)
ROW_5: Keyboard (J5.19 R18.1), MCU (U2.30)
ROW_6: Keyboard (J5.20 R19.1), MCU (U2.31)
ROW_7: Keyboard (J5.21 R20.1), MCU (U2.35)
ROW_8: Keyboard (J4.14 R5.1), MCU (U2.36)
ROW_9: Keyboard (J4.15 R6.1), MCU (U2.37)
ROW_10: Keyboard (J4.16 R7.1), MCU (U2.38)
ROW_11: Keyboard (J4.17 R8.1), MCU (U2.39)
ROW_12: Keyboard (J4.18 R9.1), MCU (U2.40)
ROW_13: Keyboard (J4.19 R10.1), MCU (U2.41)
ROW_14: Keyboard (J4.20 R11.1), MCU (U2.42)
ROW_15: Keyboard (J4.21 R12.1), MCU (U2.43)